# Altium project Sensor_Interface.PrjPcb
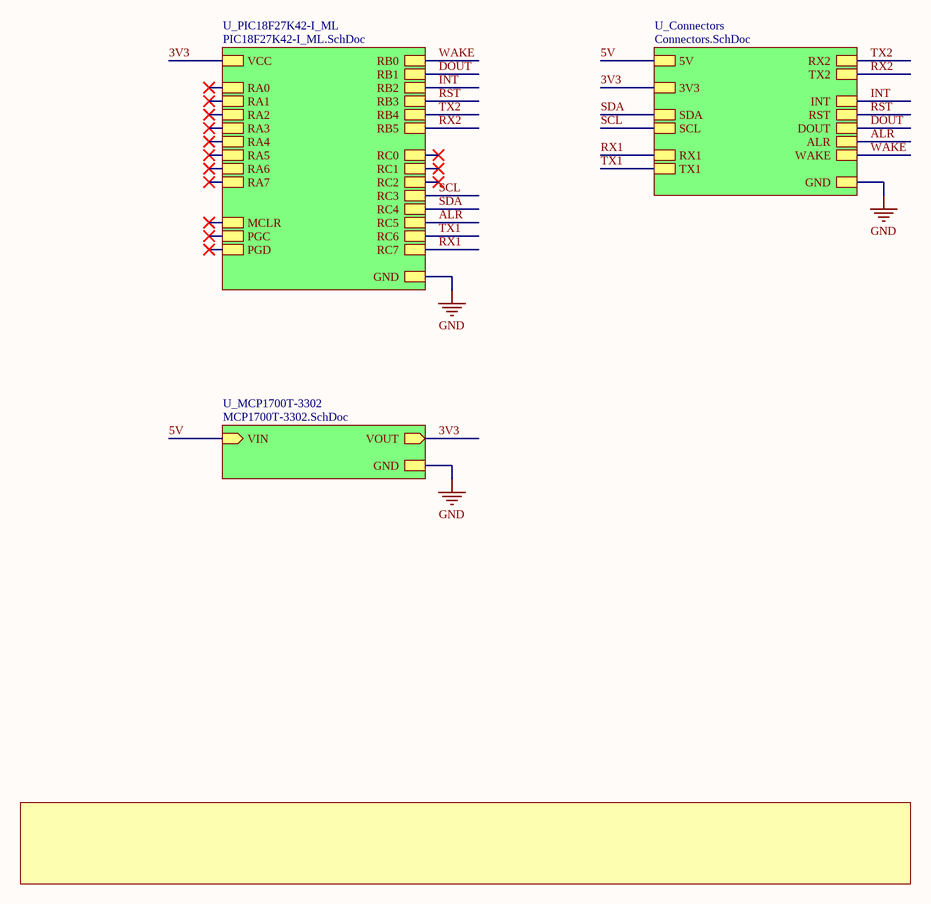
[diagram p0: Sensor_Interface.SchDoc]
4 sheets, 15 parts. Net scope: hierarchical (ports join the sheet entries above them; power ports are global).
Board file: Sensor_Interface.PcbDoc
Sheets:
  Sensor_Interface.SchDoc
    U_PIC18F27K42-I_ML = PIC18F27K42-I_ML.SchDoc
    U_MCP1700T-3302 = MCP1700T-3302.SchDoc
    U_Connectors = Connectors.SchDoc

## Sheet Sensor_Interface.SchDoc: Sensor Interface
size A4; DrawnBy: Flávio Silva; Engineer: Flávio Silva; Organization: CeNTI; Address1: Rua Fernando Mesquita 2785; Address2: Vila Nova de Famalicão; Address3: 4760-034, Portugal; Revision: 0; SheetNumber: 1; SheetTotal: 4; Project: AM2R- Safe2Wheels

### Sub-sheets
U_Connectors = Connectors.SchDoc: 5V, SCL, SDA, INT, GND, RST, DOUT, RX2, TX2, RX1, TX1, ALR, WAKE, 3V3
U_MCP1700T-3302 = MCP1700T-3302.SchDoc: VIN (in), VOUT (out), GND
U_PIC18F27K42-I_ML = PIC18F27K42-I_ML.SchDoc: VCC, GND, RA0, RA1, RA2, RA3, RA4, RA5, RA6, RA7, RC0, RC1, RC2, RC3, RC4, RC5, RC6, RC7, RB0, RB1, RB2, RB3, RB4, RB5, MCLR, PGC, PGD

### Nets
GND: sheet U_PIC18F27K42-I_ML/GND, sheet U_MCP1700T-3302/GND, sheet U_Connectors/GND
3V3: sheet U_PIC18F27K42-I_ML/VCC, sheet U_MCP1700T-3302/VOUT, sheet U_Connectors/3V3
5V: sheet U_MCP1700T-3302/VIN, sheet U_Connectors/5V
ALR: sheet U_PIC18F27K42-I_ML/RC5, sheet U_Connectors/ALR
DOUT: sheet U_PIC18F27K42-I_ML/RB1, sheet U_Connectors/DOUT
INT: sheet U_PIC18F27K42-I_ML/RB2, sheet U_Connectors/INT
RST: sheet U_PIC18F27K42-I_ML/RB3, sheet U_Connectors/RST  [project net RB3]
RX1: sheet U_PIC18F27K42-I_ML/RC7, sheet U_Connectors/RX1  [project net RC7]
RX2: sheet U_PIC18F27K42-I_ML/RB5, sheet U_Connectors/TX2  [project net RB5]
SCL: sheet U_PIC18F27K42-I_ML/RC3, sheet U_Connectors/SCL  [project net RC3]
SDA: sheet U_PIC18F27K42-I_ML/RC4, sheet U_Connectors/SDA  [project net RC4]
TX1: sheet U_PIC18F27K42-I_ML/RC6, sheet U_Connectors/TX1  [project net RC6]
TX2: sheet U_PIC18F27K42-I_ML/RB4, sheet U_Connectors/RX2  [project net RB4]
WAKE: sheet U_PIC18F27K42-I_ML/RB0, sheet U_Connectors/WAKE  [project net RB0]

### Notes on the sheet
- Title:
- Project:
- Date:
- Rev:
- Sheet
- of
- Author:

## Sheet PIC18F27K42-I_ML.SchDoc: 8-bit Microcontroller
size A4; DrawnBy: Isaque Sá; Organization: CeNTI; Address1: Rua Fernando Mesquita 2785; Address2: Vila Nova de Famalicão; Address3: 4760-034, Portugal; DocumentNumber: 1; Revision: 0; SheetNumber: 3; SheetTotal: 4; Project: AM2R- Safe2Wheels; ProjectName: Smart Systems - Hardware
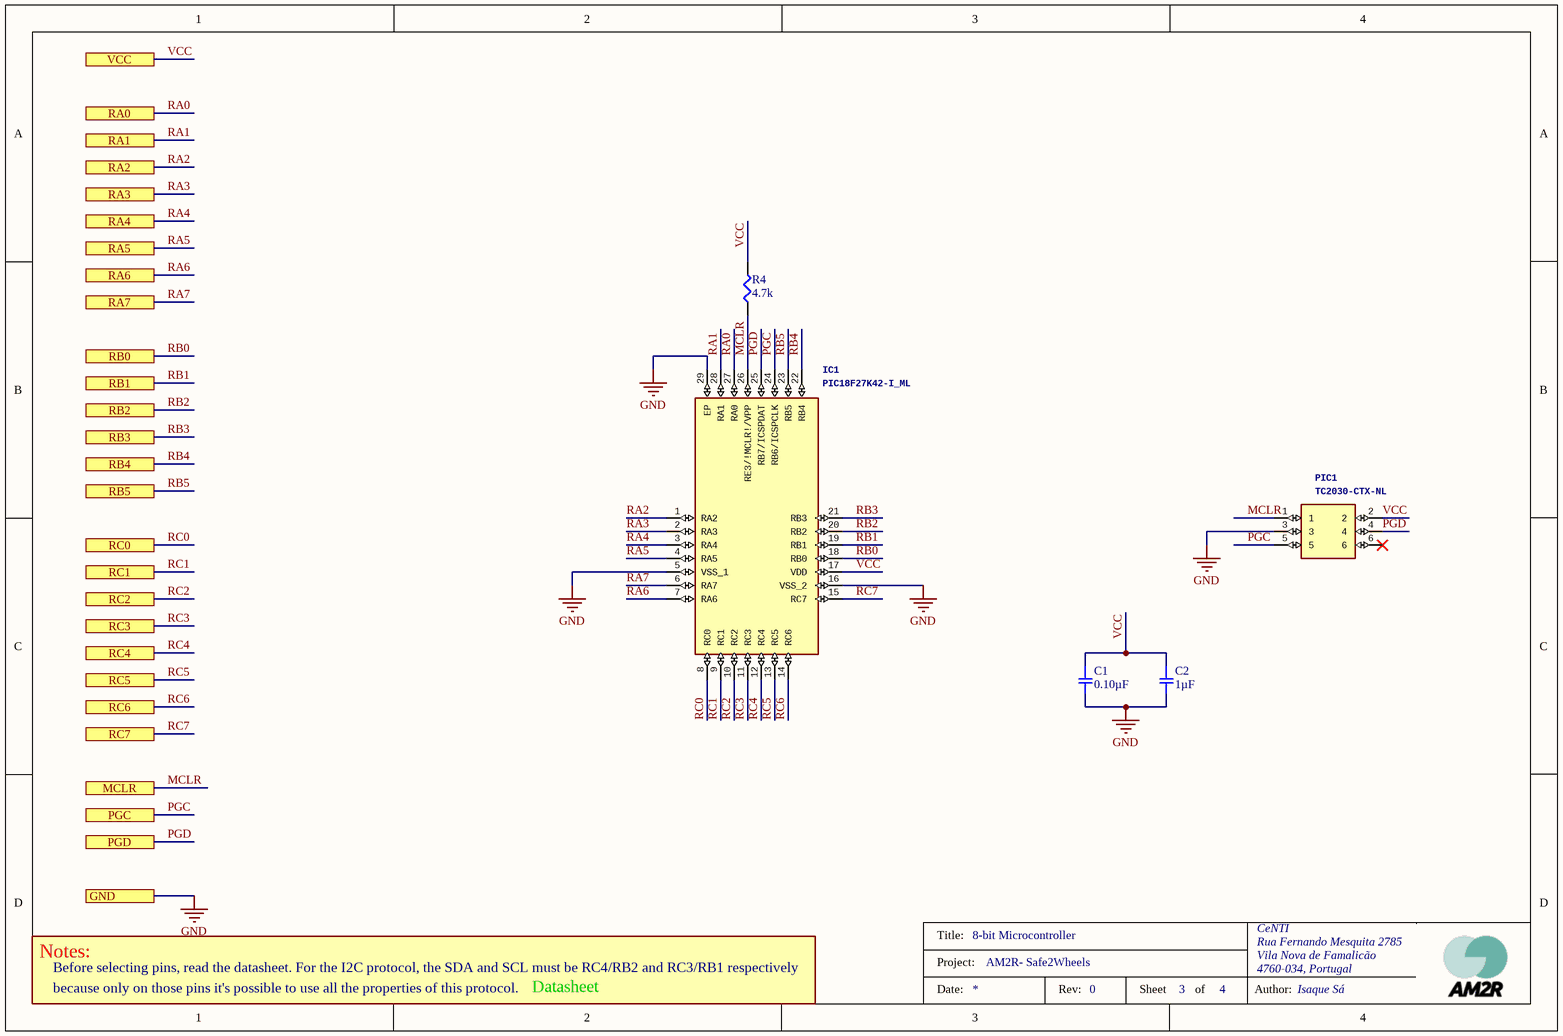
[diagram p1: PIC18F27K42-I_ML.SchDoc]

### Parts
C1  0.10µF  [SMD-0402C]
C2  1µF  [SMD-0402C]
IC1  PIC18F27K42-I_ML  [QFN28_6x6]
PIC1  TC2030-CTX-NL  [TC2030]
R4  4.7k  [SMD-0402-RES]

### Ports
GND, MCLR, PGC, PGD, RA0, RA1, RA2, RA3, RA4, RA5, RA6, RA7, RB0, RB1, RB2, RB3, RB4, RB5, RC0, RC1, RC2, RC3, RC4, RC5, RC6, RC7, VCC

### Nets
GND: C1.2 C2.2 IC1.5(VSS_1) IC1.16(VSS_2) IC1.29(EP) PIC1.3 ; port GND
MCLR: IC1.26(RE3/!MCLR!/VPP) PIC1.1 R4.1 ; port MCLR
PGC: IC1.24(RB6/ICSPCLK) PIC1.5 ; port PGC
PGD: IC1.25(RB7/ICSPDAT) PIC1.4 ; port PGD
RA0: IC1.27(RA0) ; port RA0
RA1: IC1.28(RA1) ; port RA1
RA2: IC1.1(RA2) ; port RA2
RA3: IC1.2(RA3) ; port RA3
RA4: IC1.3(RA4) ; port RA4
RA5: IC1.4(RA5) ; port RA5
RA6: IC1.7(RA6) ; port RA6
RA7: IC1.6(RA7) ; port RA7
RB0: IC1.18(RB0) ; port RB0
RB1: IC1.19(RB1) ; port RB1  [project net DOUT]
RB2: IC1.20(RB2) ; port RB2  [project net INT]
RB3: IC1.21(RB3) ; port RB3
RB4: IC1.22(RB4) ; port RB4
RB5: IC1.23(RB5) ; port RB5
RC0: IC1.8(RC0) ; port RC0
RC1: IC1.9(RC1) ; port RC1
RC2: IC1.10(RC2) ; port RC2
RC3: IC1.11(RC3) ; port RC3
RC4: IC1.12(RC4) ; port RC4
RC5: IC1.13(RC5) ; port RC5  [project net ALR]
RC6: IC1.14(RC6) ; port RC6
RC7: IC1.15(RC7) ; port RC7
VCC: C1.1 C2.1 IC1.17(VDD) PIC1.2 R4.2 ; port VCC  [project net 3V3]

Not connected (* = marked no-connect by the designer): PIC1 6*

### Notes on the sheet
- Notes:
- Before selecting pins, read the datasheet. For the I2C protocol, the SDA and SCL must be RC4/RB2 and RC3/RB1 respectively
- because only on those pins it's possible to use all the properties of this protocol.
- Datasheet <http://ww1.microchip.com/downloads/en/DeviceDoc/Microchip%208bit%20mcu%20%20PIC18%20L_F26_27_45_46_47_55_56_57K42%20low-power%20high-performance%20mcu%20with%20xlp%20tech%2040001919B.pdf>
- Title:
- Project:
- Date:
- Rev:
- Sheet
- of
- Author:

### Library data of the parts
C1 = GCM155R71C104KA55D: CAP CER 0.1UF 16V X7R 0402; Manufacturer: Murata Electronics North America; Factory Stock: 0; Unit Price (USD): 0.1; Minimum Quantity: 1; Tolerance: ±10%; Datasheets: http://www.murata.com/~/media/webrenewal/support/library/catalog/products/capacitor/mlcc/c03e.ashx; Image: //media.digikey.com/Renders/Murata%20Renders/ZRB-SERIES-0402.jpg; Digi-Key Part Number: 490-4759-1-ND; Part Number: GCM155R71C104KA55D; Quantity Available: 734194; @ qty: 0; Packaging: Cut Tape (CT); Series: GCM; Part Status: Active; Value: 0.10µF; Voltage: 16V; Temperature Coefficient: X7R; Operating Temperature: -55°C ~ 125°C; Features: -; Ratings: AEC-Q200; Applications: Automotive; Mounting Type: Surface Mount, MLCC; Package / Case: 0402 (1005 Metric); Size / Dimension: 0.039" L x 0.020" W (1.00mm x 0.50mm); Height - Seated (Max): -; Thickness (Max): 0.022" (0.55mm); Lead Spacing: -; Lead Style: -
C2 = GCM155C71A105KE38D: CAP CER 1UF 10V X7S 0402; Manufacturer: Murata Electronics North America; Factory Stock: 0; Unit Price (USD): 0.12; Minimum Quantity: 1; Tolerance: ±10%; Datasheets: http://www.murata.com/~/media/webrenewal/support/library/catalog/products/capacitor/mlcc/c03e.ashx; Image: //media.digikey.com/Renders/Murata%20Renders/ZRB-SERIES-0402.jpg; Digi-Key Part Number: 490-13409-1-ND; Part Number: GCM155C71A105KE38D; Quantity Available: 7240; @ qty: 0; Packaging: Cut Tape (CT); Series: GCM; Part Status: Active; Value: 1µF; Voltage: 10V; Temperature Coefficient: X7S; Operating Temperature: -55°C ~ 125°C; Features: -; Ratings: AEC-Q200; Applications: Automotive; Mounting Type: Surface Mount, MLCC; Package / Case: 0402 (1005 Metric); Size / Dimension: 0.039" L x 0.020" W (1.00mm x 0.50mm); Height - Seated (Max): -; Thickness (Max): 0.022" (0.55mm); Lead Spacing: -; Lead Style: -
IC1 = PIC18F27K42-I_ML: 8-bit Microcontrollers; Manufacturer_Name: Microchip; Manufacturer_Part_Number: PIC18F27K42-I/ML; GateName_1: G$1; SymbolName_1: PIC18F27K42-I_ML; LibraryName: PIC18F27K42-I_ML; DeviceSetName: PIC18F27K42-I_ML; Mouser_Part_Number: 579-PIC18F27K42-I/ML; Mouser_Price-Stock: https://www.mouser.com/Search/Refine.aspx?Keyword=579-PIC18F27K42-I%2FML; Height: 1mm
PIC1 = TC2030-CTX-NL: 6-Pin "No Legs" Cable with 10-pin micro-connector for Cortex processors; Manufacturer_Name: Tag Connect; GateName_1: G$1; SymbolName_1: TC2030-CTX-NL; LibraryName: TC2030-CTX-NL; DeviceSetName: TC2030-CTX-NL; Manufacturer_Part_Number: TC2030-CTX-NL; Height: 18mm
R4 = ERJ-2RKF4701X: RES SMD 4.7K OHM 1% 1/10W 0402; Manufacturer: Panasonic Electronic Components; Factory Stock: 0; Unit Price (USD): 0.00496; @ qty: 1500; Minimum Quantity: 1; Power (Watts): 0.1W, 1/10W; Temperature Coefficient: ±100ppm/°C; Part Number: ERJ-2RKF4701X; Datasheets: http://industrial.panasonic.com/www-cgi/jvcr13pz.cgi?E+PZ+3+AOA0002+ERJ2RKF4701X+7+WW; Image: //media.digikey.com/Photos/Panasonic%20Photos/ERJ-PA2-Series.jpg; Digi-Key Part Number: P4.70KLCT-ND; Quantity Available: 1881807; Packaging: Cut Tape (CT); Series: ERJ; Part Status: Active; Value: 4.7k; Tolerance: ±1%; Composition: Thick Film; Features: Automotive AEC-Q200; Operating Temperature: -55°C ~ 155°C; Package / Case: 0402 (1005 Metric); Supplier Device Package: 0402; Size / Dimension: 0.039" L x 0.020" W (1.00mm x 0.50mm); Height - Seated (Max): 0.016" (0.40mm); Number of Terminations: 2; Failure Rate: -

## Sheet MCP1700T-3302.SchDoc: Converter 2.3 - 6 VDC, 3.3V DC output, 0.25 A
size A4; DrawnBy: Isaque Sá; Organization: CeNTI; Address1: Rua Fernando Mesquita 2785; Address2: Vila Nova de Famalicão; Address3: 4760-034, Portugal; Revision: 0; SheetNumber: 4; SheetTotal: 4; Project: AM2R- Safe2Wheels; ProjectName: Smart Systems - Hardware
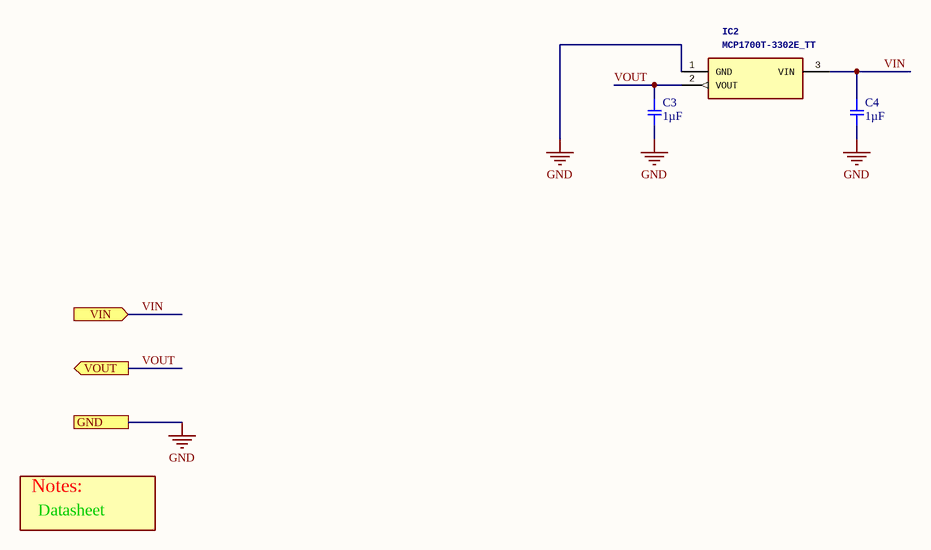
[diagram p2: MCP1700T-3302.SchDoc]

### Parts
C3  1µF  [SMD-0402C]
C4  1µF  [SMD-0402C]
IC2  MCP1700T-3302E_TT  [SOT23]

### Ports
GND, VIN (in), VOUT (out)

### Nets
GND: C3.2 C4.2 IC2.1(GND) ; port GND
VIN: C4.1 IC2.3(VIN) ; port VIN  [project net 5V]
VOUT: C3.1 IC2.2(VOUT) ; port VOUT  [project net 3V3]

### Notes on the sheet
- Notes:
- Datasheet <https://ww1.microchip.com/downloads/en/DeviceDoc/MCP1700-Low-Quiescent-Current-LDO-20001826E.pdf>
- Title:
- Project:
- Date:
- Rev:
- Sheet
- of
- Author:

### Library data of the parts
C3 C4 = GCM155C71A105KE38D: as C2 on sheet PIC18F27K42-I_ML; Datasheets: http://www.murata.com/~/media/webrenewal/support/library/catalog/products/capacitor/mlcc/c03e.ashx; Image: //media.digikey.com/Renders/Murata%20Renders/ZRB-SERIES-0402.jpg; Digi-Key Part Number: 490-13409-1-ND; Part Number: GCM155C71A105KE38D; Quantity Available: 7240; @ qty: 0; Packaging: Cut Tape (CT); Series: GCM; Part Status: Active; Value: 1µF; Voltage: 10V; Temperature Coefficient: X7S; Operating Temperature: -55°C ~ 125°C; Features: -; Ratings: AEC-Q200; Applications: Automotive; Mounting Type: Surface Mount, MLCC; Package / Case: 0402 (1005 Metric); Size / Dimension: 0.039" L x 0.020" W (1.00mm x 0.50mm); Height - Seated (Max): -; Thickness (Max): 0.022" (0.55mm); Lead Spacing: -; Lead Style: -
IC2 = MCP1700T-3302: LDO Voltage Regulator 250mA 3.3V; Manufacturer_Name: Microchip; Manufacturer_Part_Number: MCP1700T-3302E/TT; GateName_1: G$1; Allied_Number: 70046119; SymbolName_1: MCP1700T-3302E_TT; LibraryName: MCP1700T-3302E_TT; DeviceSetName: MCP1700T-3302E_TT; Mouser_Part_Number: 579-MCP1700T3302E/TT; Mouser_Price-Stock: https://www.mouser.com/Search/Refine.aspx?Keyword=579-MCP1700T3302E%2FTT; RS_Part_Number: 6989044P; RS_Price-Stock: http://uk.rs-online.com/web/p/products/6989044P; Allied_Price-Stock: http://www.alliedelec.com/microchip-technology-inc-mcp1700t-3302e-tt/70046119/; Height: 1.12mm

## Sheet Connectors.SchDoc: Connectors
size A4; DrawnBy: Flávio Silva; Engineer: Flávio Silva; Organization: CeNTI; Address1: Rua Fernando Mesquita 2785; Address2: Vila Nova de Famalicão; Address3: 4760-034, Portugal; Revision: 0; SheetNumber: 2; SheetTotal: 4; Project: AM2R- Safe2Wheels
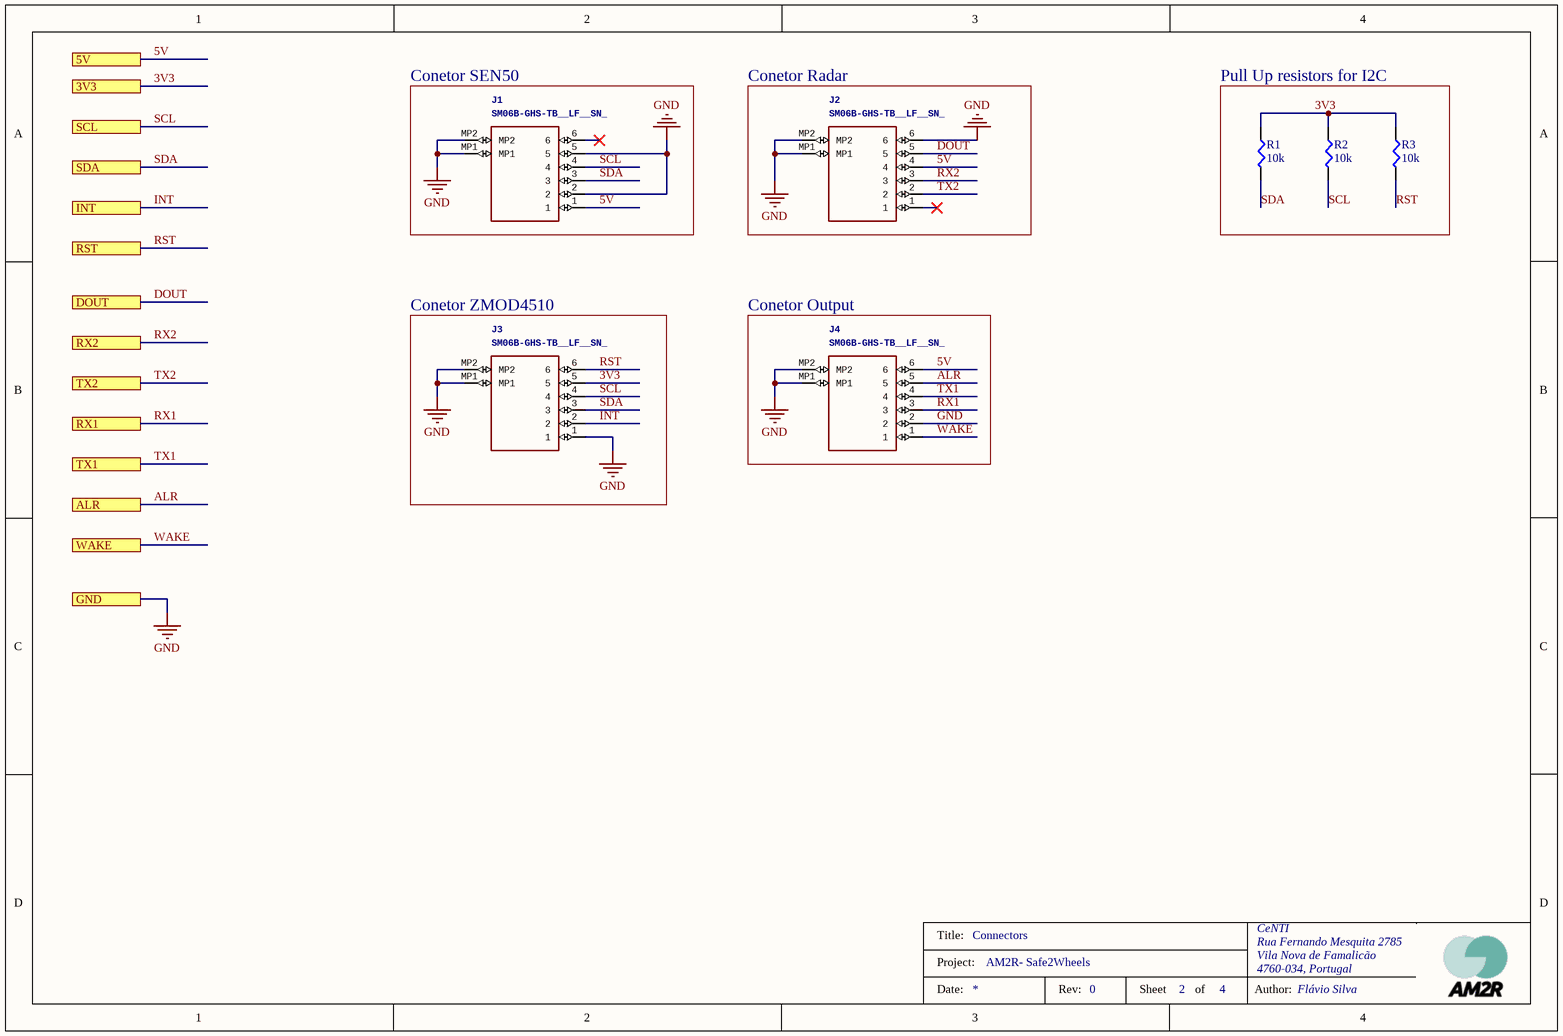
[diagram p3: Connectors.SchDoc]

### Parts
J1  SM06B-GHS-TB__LF__SN_  [SM06BGHSTBLFSN]
J2  SM06B-GHS-TB__LF__SN_  [SM06BGHSTBLFSN]
J3  SM06B-GHS-TB__LF__SN_  [SM06BGHSTBLFSN]
J4  SM06B-GHS-TB__LF__SN_  [SM06BGHSTBLFSN]
R1  10k  [SMD-0402-RES]
R2  10k  [SMD-0402-RES]
R3  10k  [SMD-0402-RES]

### Blocks framed on the sheet
Conetor SEN50: J1
Conetor Radar: J2
Pull Up resistors for I2C: R1-R3
Conetor ZMOD4510: J3
Conetor Output: J4

### Ports
3V3, 5V, ALR, DOUT, GND, INT, RST, RX1, RX2, SCL, SDA, TX1, TX2, WAKE

### Nets
GND: J1.2 J1.5 J1.MP1 J1.MP2 J2.6 J2.MP1 J2.MP2 J3.1 J3.MP1 J3.MP2 J4.2 J4.MP1 J4.MP2 ; port GND
3V3: J3.5 R1.1 R2.1 R3.1 ; port 3V3
5V: J1.1 J2.4 J4.6 ; port 5V
ALR: J4.5 ; port ALR
DOUT: J2.5 ; port DOUT
INT: J3.2 ; port INT
RST: J3.6 R3.2 ; port RST  [project net RB3]
RX1: J4.3 ; port RX1  [project net RC7]
RX2: J2.3 ; port RX2  [project net RB4]
SCL: J1.4 J3.4 R2.2 ; port SCL  [project net RC3]
SDA: J1.3 J3.3 R1.2 ; port SDA  [project net RC4]
TX1: J4.4 ; port TX1  [project net RC6]
TX2: J2.2 ; port TX2  [project net RB5]
WAKE: J4.1 ; port WAKE  [project net RB0]

Not connected (* = marked no-connect by the designer): J1 6*; J2 1*

### Notes on the sheet
- Title:
- Project:
- Date:
- Rev:
- Sheet
- of
- Author:

### Library data of the parts
J1-J4 = SM06B-GHS-TB__LF__SN_: Conn Shrouded Header HDR 6 POS 1.25mm Solder RA Side Entry SMD T/R   Source:  Datasheet; Manufacturer_Name: JST (JAPAN SOLDERLESS TERMINALS); Manufacturer_Part_Number: SM06B-GHS-TB (LF)(SN); GateName_1: G$1; SymbolName_1: SM06B-GHS-TB__LF__SN_; LibraryName: SM06B-GHS-TB__LF__SN_; DeviceSetName: SM06B-GHS-TB__LF__SN_; Arrow_Part_Number: SM06B-GHS-TB (LF)(SN); Arrow_Price-Stock: https://www.arrow.com/en/products/sm06b-ghs-tb-lf-sn/jst-manufacturing; Height: 4.25mm
R1-R3 = ERJ-2GEJ103X: RES SMD 10K OHM 5% 1/10W 0402; Manufacturer: Panasonic Electronic Components; Factory Stock: 0; Unit Price (USD): 0.00350; @ qty: 1500; Minimum Quantity: 1; Power (Watts): 0.1W, 1/10W; Temperature Coefficient: ±200ppm/°C; Part Number: ERJ-2GEJ103X; Datasheets: http://industrial.panasonic.com/www-cgi/jvcr13pz.cgi?E+PZ+3+AOA0001+ERJ2GEJ103X+7+WW; Image: //media.digikey.com/Photos/Panasonic%20Photos/ERJ-PA2-Series.jpg; Digi-Key Part Number: P10KJCT-ND; Quantity Available: 2560215; Packaging: Cut Tape (CT); Series: ERJ; Part Status: Active; Value: 10k; Tolerance: ±5%; Composition: Thick Film; Features: Automotive AEC-Q200; Operating Temperature: -55°C ~ 155°C; Package / Case: 0402 (1005 Metric); Supplier Device Package: 0402; Size / Dimension: 0.039" L x 0.020" W (1.00mm x 0.50mm); Height - Seated (Max): 0.016" (0.40mm); Number of Terminations: 2; Failure Rate: -

## Nets that join several sheets
GND: PIC18F27K42-I_ML (6 pins), MCP1700T-3302 (C3.2 C4.2 IC2.1), Connectors (13 pins)
3V3: PIC18F27K42-I_ML (5 pins), MCP1700T-3302 (C3.1 IC2.2), Connectors (J3.5 R1.1 R2.1 R3.1)
5V: MCP1700T-3302 (C4.1 IC2.3), Connectors (J1.1 J2.4 J4.6)
ALR: PIC18F27K42-I_ML (IC1.13), Connectors (J4.5)
DOUT: PIC18F27K42-I_ML (IC1.19), Connectors (J2.5)
INT: PIC18F27K42-I_ML (IC1.20), Connectors (J3.2)
RB0: PIC18F27K42-I_ML (IC1.18), Connectors (J4.1)
RB3: PIC18F27K42-I_ML (IC1.21), Connectors (J3.6 R3.2)
RB4: PIC18F27K42-I_ML (IC1.22), Connectors (J2.3)
RB5: PIC18F27K42-I_ML (IC1.23), Connectors (J2.2)
RC3: PIC18F27K42-I_ML (IC1.11), Connectors (J1.4 J3.4 R2.2)
RC4: PIC18F27K42-I_ML (IC1.12), Connectors (J1.3 J3.3 R1.2)
RC6: PIC18F27K42-I_ML (IC1.14), Connectors (J4.4)
RC7: PIC18F27K42-I_ML (IC1.15), Connectors (J4.3)